# EAGLE schematic Telemetry_layoutmainVer3 (EAGLE 8.2.1)
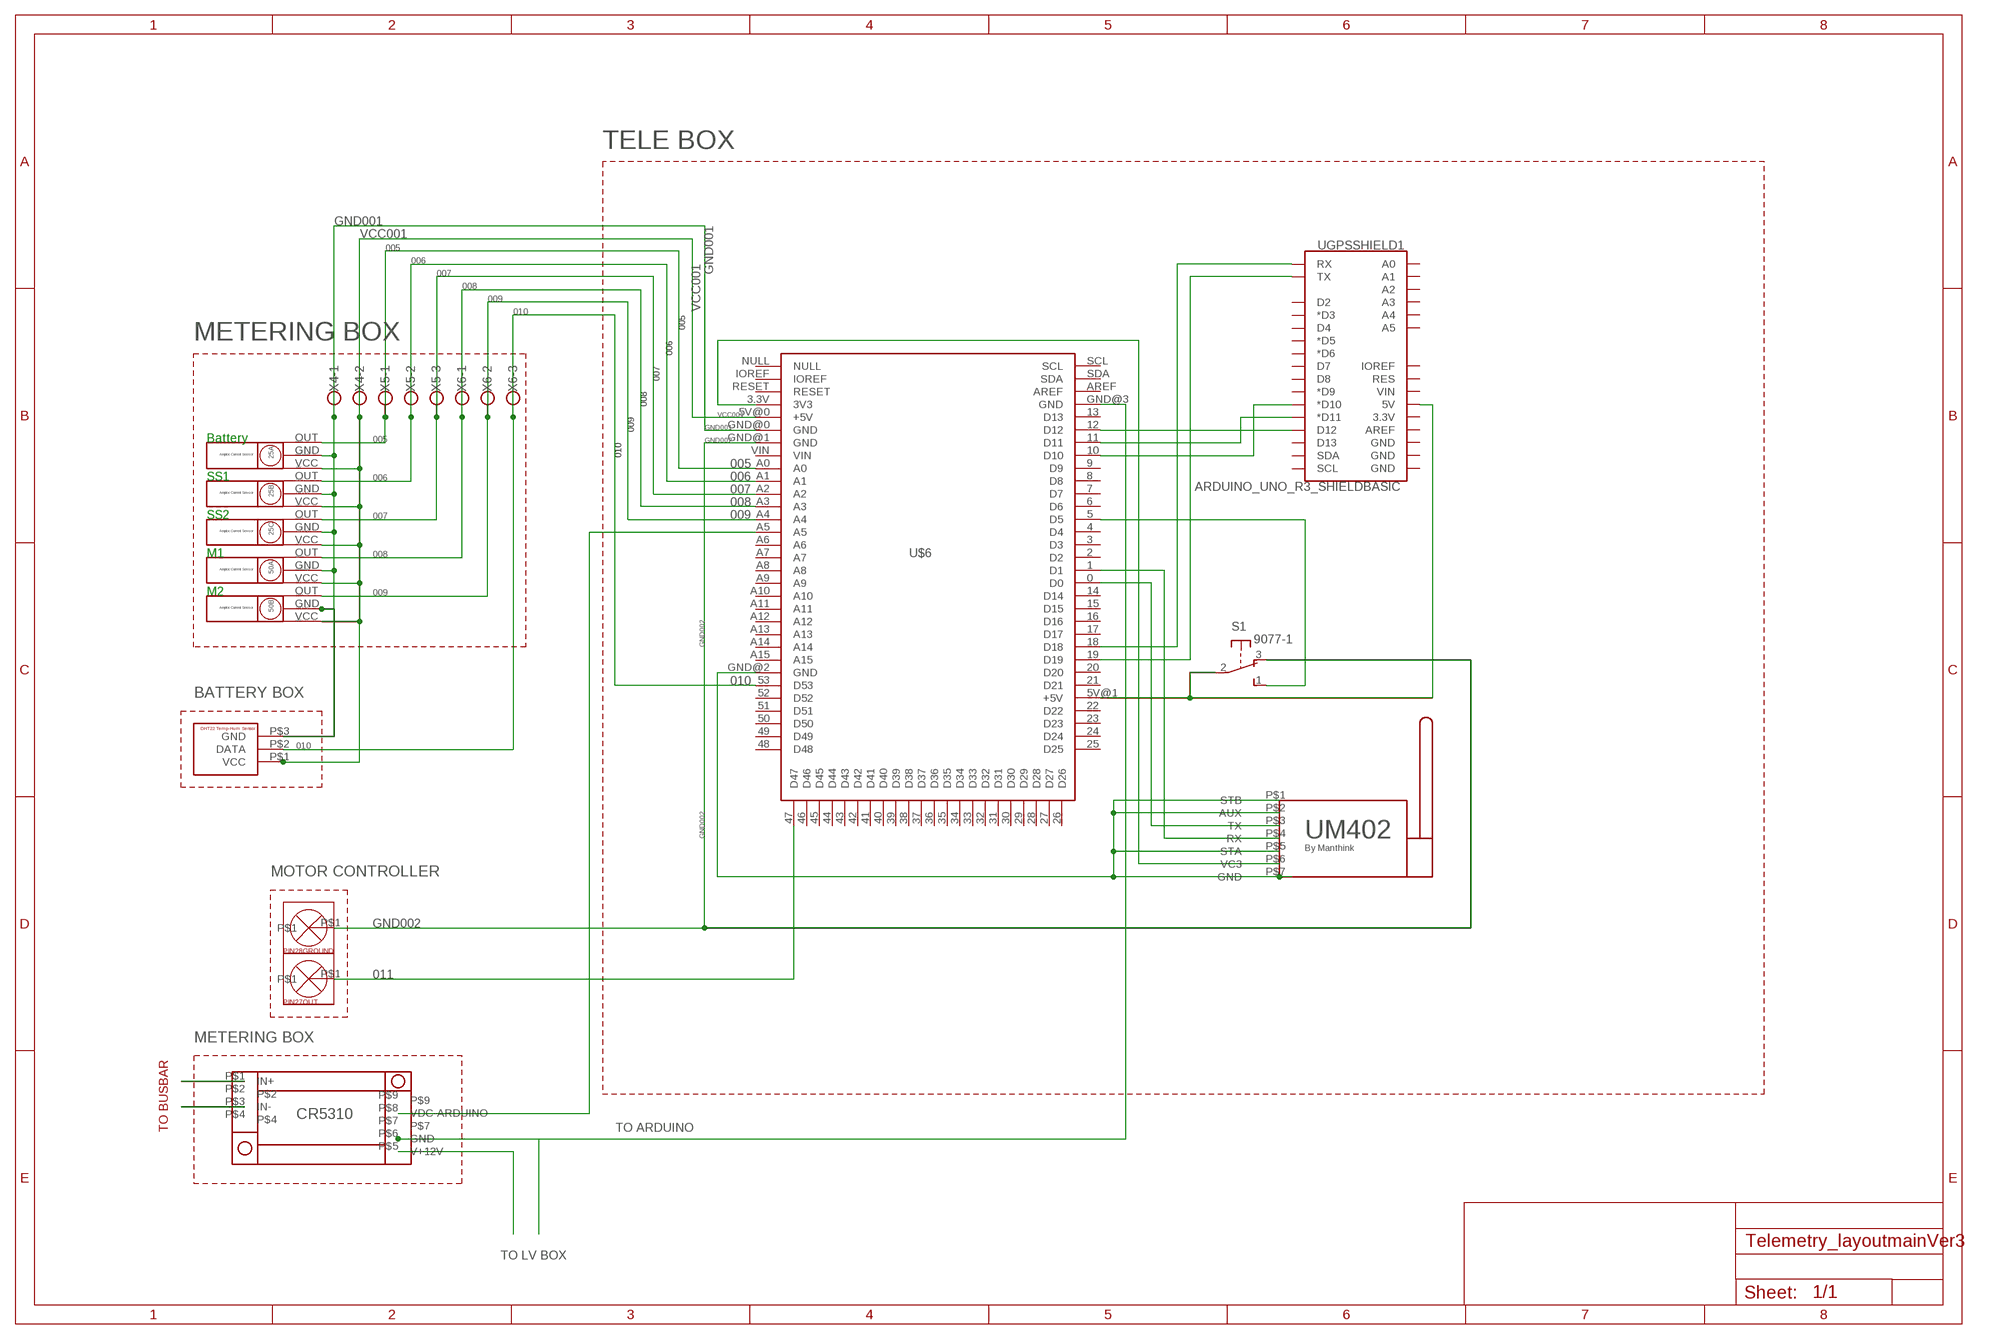
[diagram p0: schematic, sheet 1]

## Parts
25A  AMPLOC-CS  [AMPLOC]
25B  AMPLOC-CS  [AMPLOC]
25C  AMPLOC-CS  [AMPLOC]
50A  AMPLOC-CS  [AMPLOC]
50B  AMPLOC-CS  [AMPLOC]
PIN27OUT  SCREWTERMINAL  [SCREWTERMINAL]
PIN28GROUND  SCREWTERMINAL  [SCREWTERMINAL]
S1  9077-1  [9077-1]
U$1  CR5310  [CR5310]
U$2  UM402  [UM402]
U$6  PSCREWBPROTOSCREWSHIELD  [ARDUINO_MEGA]
U$8  DHT22  [DHT22]
UGPSSHIELD1  ARDUINO_UNO_R3_SHIELDBASIC  [UNO_R3_SHIELD]
X4  W237-102  [W237-102]
X5  W237-103  [W237-103]
X6  W237-103  [W237-103]

## Nets
N$1: U$2.P$1(STB) U$2.P$2(AUX) U$2.P$5(STA) U$2.P$7(GND) U$6.GND@2(GND)
N$3: PIN27OUT.P$1 U$6.47(D47)
N$4: U$1.P$5(V+12V)
N$5: U$1.P$3(IN-)
N$6: U$1.P$1(IN+)
N$7: U$1.P$8(VDC-ARDUINO) U$6.A5
N$8: 25A.VCC 25B.VCC 25C.VCC 50A.VCC 50B.VCC U$6.5V@0(+5V) U$8.P$1(VCC) X4.2
N$9: U$2.P$6(VC3) U$6.3.3V(3V3)
N$10: 25A.GND 25B.GND 25C.GND 50A.GND 50B.GND U$6.GND@0(GND) U$8.P$3(GND) X4.1
N$11: U$2.P$3(TX) U$6.0(D0)
N$12: U$2.P$4(RX) U$6.1(D1)
N$13: PIN28GROUND.P$1 S1.3(O) U$6.GND@1(GND)
N$14: S1.1(S) U$6.5(D5)
N$37: U$1.P$6(GND) U$6.GND@3(GND)
N$38: S1.2(P) U$6.5V@1(+5V) UGPSSHIELD1.5V
N$40: U$6.18(D18) UGPSSHIELD1.RX
N$41: U$6.19(D19) UGPSSHIELD1.TX
N$42: U$6.10(D10) UGPSSHIELD1.D10(*D10)
N$43: U$6.11(D11) UGPSSHIELD1.D11(*D11)
N$44: U$6.12(D12) UGPSSHIELD1.D12
N$45: 50B.OUT U$6.A4 X6.2
N$52: 50A.OUT U$6.A3 X6.1
N$53: 25A.OUT U$6.A0 X5.1
N$54: 25C.OUT U$6.A2 X5.3
N$55: 25B.OUT U$6.A1 X5.2
N$58: U$6.53(D53) U$8.P$2(DATA) X6.3
Unconnected: U$1.P$2 U$1.P$4 U$1.P$7 U$1.P$9 U$6.2(D2) U$6.3(D3) U$6.4(D4) U$6.6(D6) U$6.7(D7) U$6.8(D8) U$6.9(D9) U$6.13(D13) U$6.14(D14) U$6.15(D15) U$6.16(D16) U$6.17(D17) U$6.20(D20) U$6.21(D21) U$6.22(D22) U$6.23(D23) U$6.24(D24) U$6.25(D25) U$6.26(D26) U$6.27(D27) U$6.28(D28) U$6.29(D29) U$6.30(D30) U$6.31(D31) U$6.32(D32) U$6.33(D33) U$6.34(D34) U$6.35(D35) U$6.36(D36) U$6.37(D37) U$6.38(D38) U$6.39(D39) U$6.40(D40) U$6.41(D41) U$6.42(D42) U$6.43(D43) U$6.44(D44) U$6.45(D45) U$6.46(D46) U$6.48(D48) U$6.49(D49) U$6.50(D50) U$6.51(D51) U$6.52(D52) U$6.A6 U$6.A7 U$6.A8 U$6.A9 U$6.A10 U$6.A11 U$6.A12 U$6.A13 U$6.A14 U$6.A15 U$6.AREF U$6.IOREF U$6.NULL U$6.RESET U$6.SCL U$6.SDA U$6.VIN UGPSSHIELD1.3.3V UGPSSHIELD1.A0 UGPSSHIELD1.A1 UGPSSHIELD1.A2 UGPSSHIELD1.A3 UGPSSHIELD1.A4 UGPSSHIELD1.A5 UGPSSHIELD1.AREF UGPSSHIELD1.D2 UGPSSHIELD1.D3(*D3) UGPSSHIELD1.D4 UGPSSHIELD1.D5(*D5) UGPSSHIELD1.D6(*D6) UGPSSHIELD1.D7 UGPSSHIELD1.D8 UGPSSHIELD1.D9(*D9) UGPSSHIELD1.D13 UGPSSHIELD1.GND@0(GND) UGPSSHIELD1.GND@1(GND) UGPSSHIELD1.GND@2(GND) UGPSSHIELD1.IOREF UGPSSHIELD1.RES UGPSSHIELD1.SCL UGPSSHIELD1.SDA UGPSSHIELD1.VIN

## Notes on the sheet
- TELE BOX
- GND001 | GND001
- VCC001
- 005
- 006 | VCC001
- 007
- 008
- 009
- 010 | 005
- METERING BOX | 006
- 007
- 008
- 009 | VCC001
- GND001
- Battery | 005 | 010 | GND002
- 005
- SS1 | 006 | 006
- 007
- 008
- SS2 | 007 | 009
- M1 | 008
- M2 | 009
- GND002
- 010
- BATTERY BOX
- 010
- GND002
- MOTOR CONTROLLER
- GND002
- 011
- METERING BOX
- TO BUSBAR | TO ARDUINO
- TO LV BOX

## Library data of the parts
25A 25B 25C 50A 50B = TelemetryCustom:AMPLOC-CS
PIN27OUT PIN28GROUND = TelemetryCustom:SCREWTERMINAL
S1 = switch-misc:9077-1: MARQUARDT SWITCH 9077.0100 Distributor: Buerklin <https://www.buerklin.com/default.asp?event=ShowArtikel%2812G2820%29&l=d&jump=ArtNr_12G2820>
U$1 = TelemetryCustom:CR5310
U$2 = TelemetryCustom:UM402
U$6 = TelemetryCustom:PSCREWB
U$8 = TelemetryCustom:DHT22
UGPSSHIELD1 = SparkFun-Boards:ARDUINO_UNO_R3_SHIELD: Arduino R3 Shield Footprint Shield form compatible with the Arduino Uno R3. SparkFun Products: MG2639 Cellular Shield <https://www.sparkfun.com/products/13120> MIDI Shield <https://www.sparkfun.com/products/12898> R3 Stackable Headers Kit <https://www.sparkfun.com/products/11417>
X4 = con-wago-500:W237-102: WAGO SCREW CLAMP; MPN: 237-102; OC_FARNELL: unknown; OC_NEWARK: 70K9898
X5 X6 = con-wago-500:W237-103: WAGO SCREW CLAMP; MPN: 237-103; OC_FARNELL: unknown; OC_NEWARK: 18M7116